# Altium schematic sheet 1-POWER.SchDoc
size B
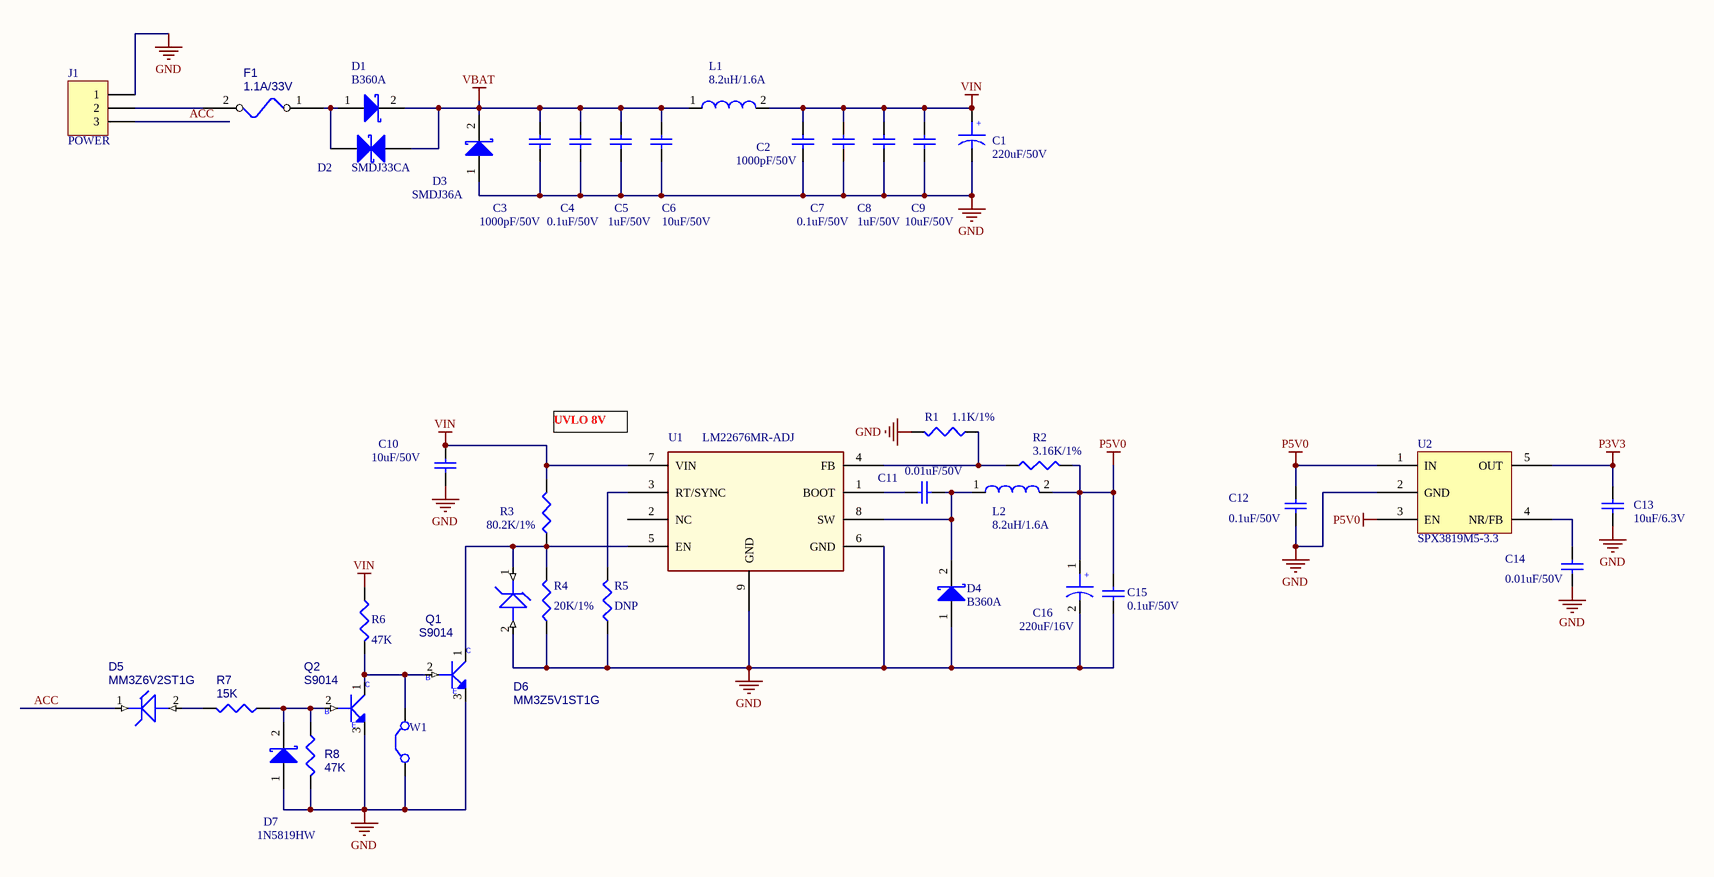
[diagram p0: 1-POWER.SchDoc]

## Parts
C1  220uF/50V  [DL-10*10.5]
C2  1000pF/50V  [0402]
C3  1000pF/50V  [0402]
C4  0.1uF/50V  [0402]
C5  1uF/50V  [0805]
C6  10uF/50V  [1210]
C7  0.1uF/50V  [0402]
C8  1uF/50V  [0805]
C9  10uF/50V  [1210]
C10  10uF/50V  [1210]
C11  0.01uF/50V  [0402]
C12  0.1uF/50V  [0402]
C13  10uF/6.3V  [0603]
C14  0.01uF/50V  [0402]
C15  0.1uF/50V  [0402]
C16  220uF/16V  [DL-8*10.5]
D1  B360A  [B320A]
D2  SMDJ33CA  [SMC]
D3  SMDJ36A  [SMC]
D4  B360A  [B320A]
D5  MM3Z6V2ST1G  [SOD323F]
D6  MM3Z5V1ST1G  [SOD323F]
D7  1N5819HW  [1N5819]
F1  1.1A/33V  [1812]
J1  POWER  [XH2.54-SMT-V-3P]
L1  8.2uH/1.6A  [IND-SMD-5.8*5.8]
L2  8.2uH/1.6A  [IND-SMD-5.8*5.8]
Q1  S9014  [NPN]
Q2  S9014  [NPN]
R1  1.1K/1%  [0402]
R2  3.16K/1%  [0402]
R3  80.2K/1%  [0402]
R4  20K/1%  [0402]
R5  DNP  [0402]
R6  47K  [0402]
R7  15K  [0603]
R8  47K  [0402]
U1  LM22676MR-ADJ  [PSO8]
U2  SPX3819M5-3.3  [SOT23-5]
W1  Jumper  [SHORTCUT]  (value not drawn)

## Nets
GND: C1.2 C2.2 C3.2 C4.2 C5.2 C6.2 C7.2 C8.2 C9.2 C10.2 C12.1 C13.1 C14.1 C15.1 C16.2 D3.1(A) D4.1(A) D6.2 D7.1(A) J1.1 Q1.3(EMITTER) Q2.3(EMITTER) R1.2 R4.1 R5.1 R8.2 U1.6(GND) U1.9(GND) U2.2(GND) W1.1(C1)
P3V3: C13.2 U2.5(OUT)
P5V0: C12.2 C15.2 C16.1 L2.2 R2.2 U2.1(IN) U2.3(EN)
VBAT: C3.1 C4.1 C5.1 C6.1 D1.2(K) D2.2 D3.2(K) L1.1
VIN: C1.1 C2.1 C7.1 C8.1 C9.1 C10.1 L1.2 R3.2 R6.1 U1.7(VIN)
ACC: D5.1 J1.3
NetC11_1: C11.1 D4.2(K) L2.1 U1.8(SW)
NetC11_2: C11.2 U1.1(BOOT)
NetC14_2: C14.2 U2.4(NR/FB)
NetD1_1: D1.1(A) D2.1 F1.1
NetD5_2: D5.2 R7.2
NetD6_1: D6.1 Q1.1(COLLECTOR) R3.1 R4.2 U1.5(EN)
NetD7_2: D7.2(K) Q2.2(BASE) R7.1 R8.1
NetF1_2: F1.2 J1.2
NetQ1_2: Q1.2(BASE) Q2.1(COLLECTOR) R6.2 W1.2(C2)
NetR1_1: R1.1 R2.1 U1.4(FB)
NetR5_2: R5.2 U1.3(RT/SYNC)

Not connected (* = marked no-connect by the designer): U1 2(NC)

## Notes on the sheet
- UVLO 8V
- (in symbol CAP WP) +
- (in symbol MMBT3904_NL_SOT23-3) C; B; E

## Library data of the parts
C1 C16 = CAP WP
C2-C10 = Cap: Capacitor; Published: 8-Jun-2000; LatestRevisionDate: 17-Jul-2002; LatestRevisionNote: Re-released for DXP Platform.; PackageReference: RAD-0.3; Publisher: Altium Limited; PackageDescription: Radial Cap, Thru-Hole; 2 Leads; 0.3 in Pin Spacing
C11-C15 = Cap: Capacitor; Value: 0.1uF; Published: 8-Jun-2000; LatestRevisionDate: 17-Jul-2002; LatestRevisionNote: Re-released for DXP Platform.; PackageReference: RAD-0.3; Publisher: Altium Limited; PackageDescription: Radial Cap, Thru-Hole; 2 Leads; 0.3 in Pin Spacing
D1 D3 D4 D7 = Diode 11DQ03: Schottky Rectifier
D2 = TVS-BI
D5 D6 = MMGZ5231BPTLL34
F1 = 2A_32VDC_0467-002
J1 = Header 3: Header, 3-Pin; LatestRevisionDate: 17-Jul-2002; LatestRevisionNote: Re-released for DXP Platform.; Publisher: Altium Limited
L1 L2 = 4.7UH_CDH2D09BNP-4R7MC_0.7A_20%: Part Number: SH00000AJ00; ROOM: +1.3V_CORE
Q1 Q2 = MMBT3904_NL_SOT23-3: Part Description: S TR MMBT3904_NL NPN SOT23; Part Number: SB039040000
R1-R6 = Res3: Resistor; Value: 1K; Published: 8-Jun-2000; LatestRevisionDate: 29-May-2009; LatestRevisionNote: IPC-7351 Footprint Added.; PackageReference: J1-0603; Publisher: Altium Limited; PackageDescription: Chip Resistor
R7 R8 = R
U1 = LM22670_0
U2 = TPS73633DBVT
W1 = Jumper: Jumper Wire; Published: 24-Mar-1999; LatestRevisionDate: 17-Jul-2002; LatestRevisionNote: Re-released for DXP Platform.; PackageReference: RAD-0.2; Publisher: Altium Limited; PackageDescription: Radial Cap, Thru-Hole; 2 Leads; 0.2 in Pin Spacing